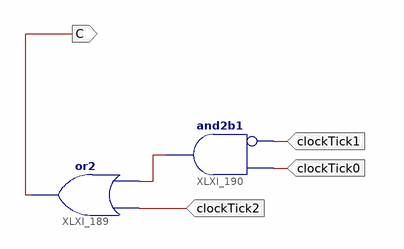
[diagram p0: schematic sheet 1]
// Xilinx ISE schematic YOGI_S.sch (spartan3e) as structural Verilog: 2 symbols, 4 ports
module YOGI_S (
  input  clockTick2,
  input  clockTick0,
  input  clockTick1,
  output C
);

  wire XLXN_679;

  or XLXI_189 (C, XLXN_679, clockTick2);
  and XLXI_190 (XLXN_679, ~clockTick1, clockTick0);  // and2b1
endmodule
